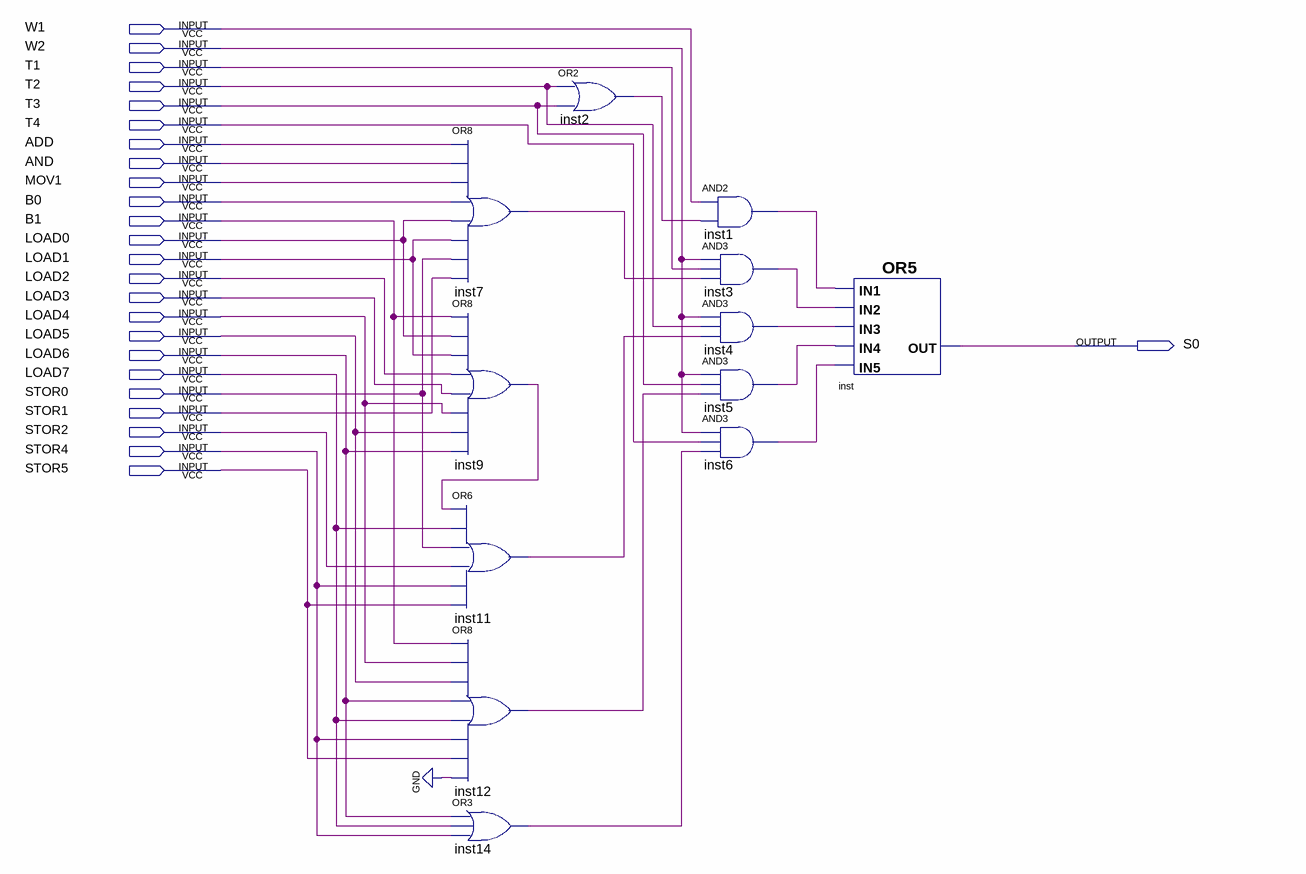
[diagram p0: schematic sheet]
// Quartus schematic S0.bdf as structural Verilog: 12 symbols, 25 pins
module S0 (
  input  W1,
  input  W2,
  input  T1,
  input  T2,
  input  T3,
  input  T4,
  input  ADD,
  input  AND,
  input  MOV1,
  input  B0,
  input  B1,
  input  LOAD0,
  input  LOAD1,
  input  LOAD2,
  input  LOAD3,
  input  LOAD4,
  input  LOAD5,
  input  LOAD6,
  input  LOAD7,
  input  STOR0,
  input  STOR1,
  input  STOR2,
  input  STOR4,
  input  STOR5,
  output S0
);

  wire inst1_out, inst2_out, inst3_out, inst4_out, inst5_out, inst6_out, inst7_out, inst9_out, inst11_out,
       inst12_out, inst14_out;

  or inst7 (inst7_out, ADD, AND, MOV1, B0, LOAD0, LOAD1, STOR0, STOR1);
  or inst9 (inst9_out, B1, LOAD0, LOAD1, LOAD2, LOAD3, LOAD4, LOAD5, LOAD6);
  or inst11 (inst11_out, inst9_out, LOAD7, STOR0, STOR2, STOR4, STOR5);
  or inst12 (inst12_out, B1, LOAD4, LOAD5, LOAD6, LOAD7, STOR4, STOR5, 1'b0);
  or inst14 (inst14_out, LOAD6, LOAD7, STOR4);
  or inst2 (inst2_out, T2, T3);
  and inst1 (inst1_out, W1, inst2_out);
  and inst3 (inst3_out, W2, T1, inst7_out);
  and inst4 (inst4_out, W2, T2, inst11_out);
  and inst5 (inst5_out, W2, T3, inst12_out);
  and inst6 (inst6_out, W2, T4, inst14_out);
  or inst (S0, inst1_out, inst3_out, inst4_out, inst5_out, inst6_out);
endmodule
